# Altium schematic sheet Resistors.SchDoc
size A; SheetNumber: 4; SheetTotal: 5
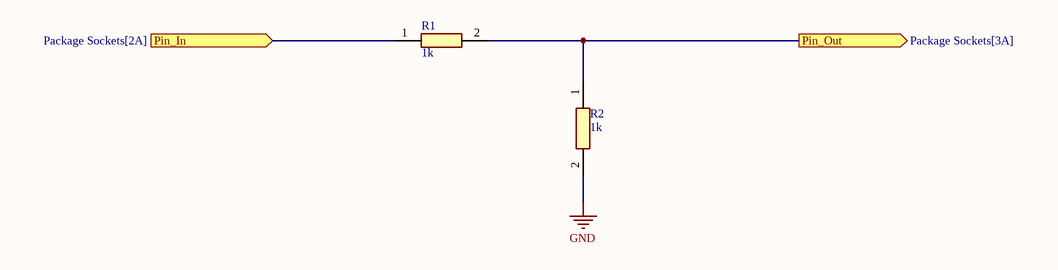
[diagram p0: Resistors.SchDoc]

## Parts
R1  1k  [RESC1608X55N]
R2  1k  [RESC1608X55N]

## Ports
Pin_In (in, see Package Sockets[2A]), Pin_Out (out, see Package Sockets[3A])

## Nets
GND: R2.2
Pin_In: R1.1 ; port Pin_In
Pin_Out: R1.2 R2.1 ; port Pin_Out

## Library data of the parts
R1 R2 = RMCF0603FT1K00: Manufacturer_Name: Stackpole Electronics; Datasheet Link: https://www.seielect.com/Catalog/SEI-RMCF_RMCP.pdf; Height: 0.55mm; Manufacturer_Part_Number: RMCF0603FT1K00; Mouser Part Number: 708-RMCF0603FT1K00; Mouser Price/Stock: https://www.mouser.co.uk/ProductDetail/SEI-Stackpole/RMCF0603FT1K00?qs=FESYatJ8odI%252BYiPlprc1Pg%3D%3D; Arrow Part Number: RMCF0603FT1K00; Arrow Price/Stock: https://www.arrow.com/en/products/rmcf0603ft1k00/stackpole-electronics?utm_currency=USD&region=nac